# Altium project New Gyro 4.0.PrjPcb
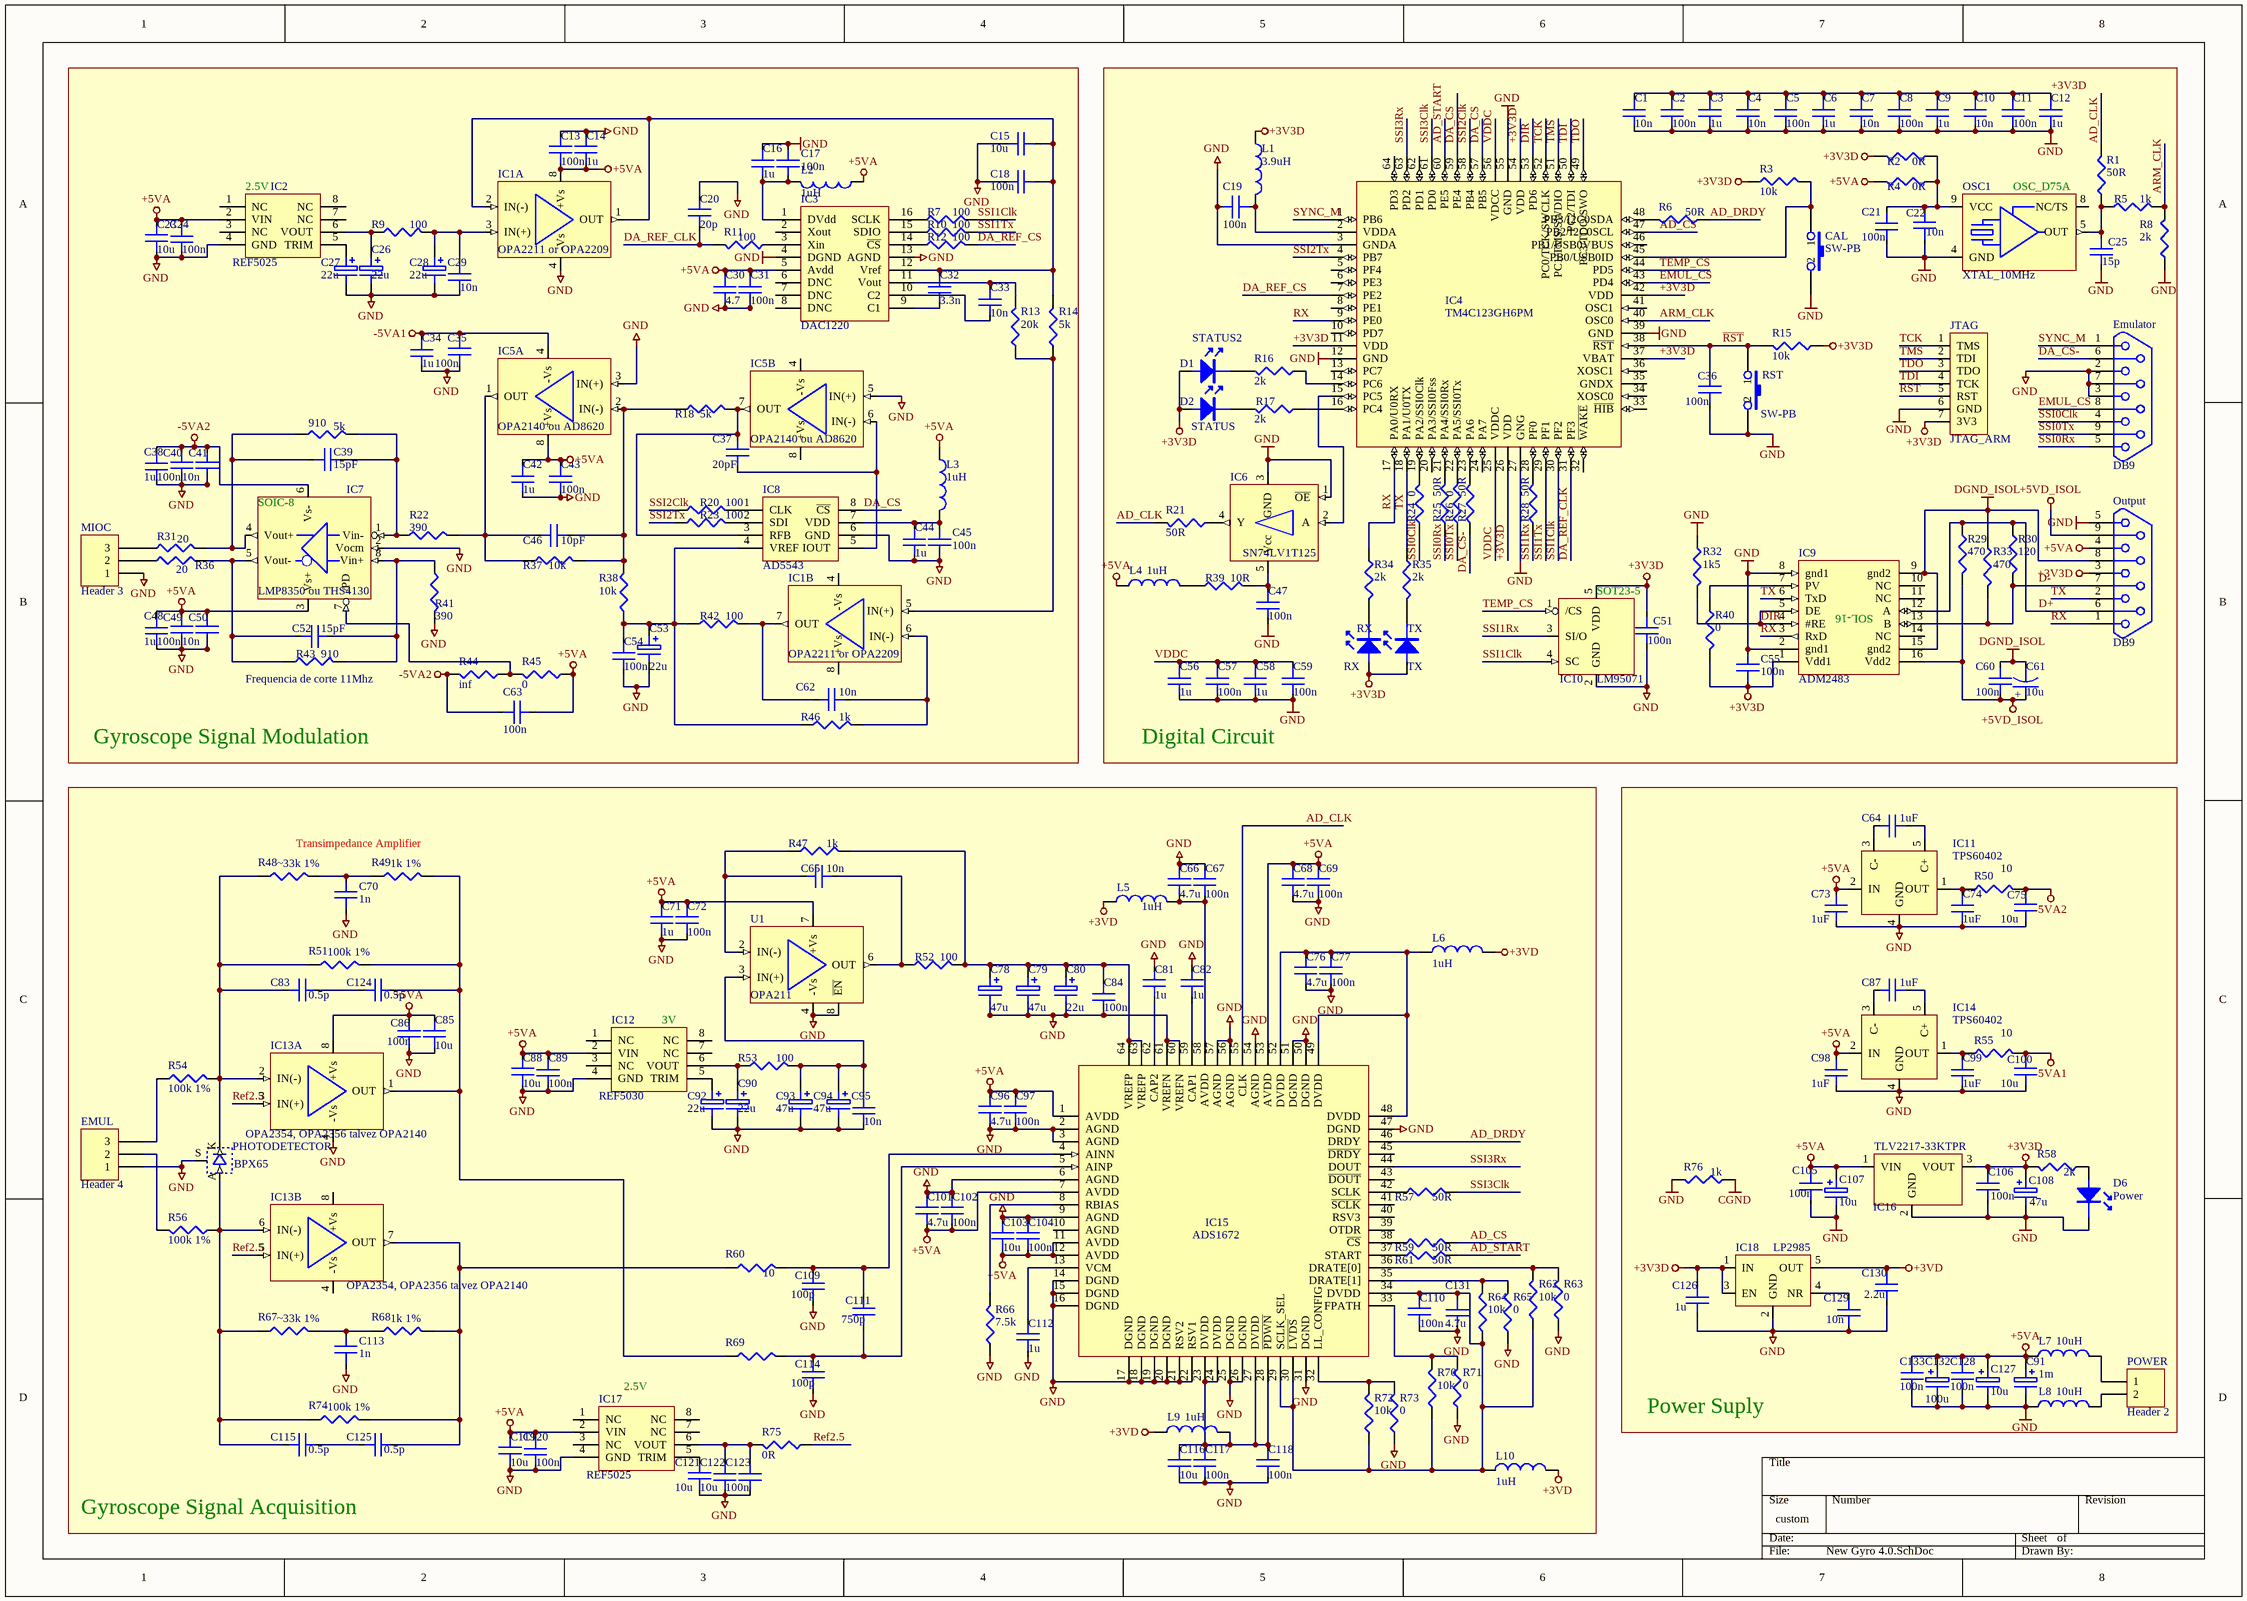
[diagram p0: New Gyro 4.0.SchDoc]
1 sheet, 253 parts. Net scope: global (net labels, ports and power ports of the same name join across sheets).
Board file: New Gyro 4.0.PcbDoc

## Sheet New Gyro 4.0.SchDoc
size 449 x 320 mm

### Parts
910  5k  [0805]
C1  10n  [0805-cap]
C2  100n  [0805-cap]
C3  1u  [0805-cap]
C4  10n  [0805-cap]
C5  100n  [0805-cap]
C6  1u  [0805-cap]
C7  10n  [0805-cap]
C8  100n  [0805-cap]
C9  1u  [0805-cap]
C10  10n  [0805-cap]
C11  100n  [0805-cap]
C12  1u  [0805-cap]
C13  100n  [0805-cap]
C14  1u  [0805-cap]
C15  10u  [0805-cap]
C16  1u  [0805-cap]
C17  100n  [0805-cap]
C18  100n  [0805-cap]
C19  100n  [0805-cap]
C20  20p  [0805-cap]
C21  100n  [0805-cap]
C22  10n  [0805-cap]
C23  10u  [0805-cap]
C24  100n  [0805-cap]
C25  15p  [0805-cap]
C26  22u  [0805-cap]
C27  22u  [0805-cap]
C28  22u  [0805-cap]
C29  10n  [0805-cap]
C30  4.7  [0805-cap]
C31  100n  [0805-cap]
C32  3.3n  [0805-cap]
C33  10n  [0805-cap]
C34  1u  [0805-cap]
C35  100n  [0805-cap]
C36  100n  [0805-cap]
C37  20pF  [0805-cap]
C38  1u  [0805-cap]
C39  15pF  [0805-cap]
C40  100n  [0805-cap]
C41  10n  [0805-cap]
C42  1u  [0805-cap]
C43  100n  [0805-cap]
C44  1u  [0805-cap]
C45  100n  [0805-cap]
C46  10pF  [0805-cap]
C47  100n  [0805-cap]
C48  1u  [0805-cap]
C49  100n  [0805-cap]
C50  10n  [0805-cap]
C51  100n  [0805-cap]
C52  15pF  [0805-cap]
C53  22u  [0805-cap]
C54  100n  [0805-cap]
C55  100n  [0805-cap]
C56  1u  [0805-cap]
C57  100n  [0805-cap]
C58  1u  [0805-cap]
C59  100n  [0805-cap]
C60  100n  [0805-cap]
C61  10u  [0805-cap]
C62  10n  [0805-cap]
C63  100n  [0805-cap]
C64  1uF  [0805-cap]
C65  10n  [0805-cap]
C66  4.7u  [0805-cap]
C67  100n  [0805-cap]
C68  4.7u  [0805-cap]
C69  100n  [0805-cap]
C70  1n  [0805-cap]
C71  1u  [0805-cap]
C72  100n  [0805-cap]
C73  1uF  [0805-cap]
C74  1uF  [0805-cap]
C75  10u  [0805-cap]
C76  4.7u  [0805-cap]
C77  100n  [0805-cap]
C78  47u  [0805-cap]
C79  47u  [0805-cap]
C80  22u  [0805-cap]
C81  1u  [0805-cap]
C82  1u  [0805-cap]
C83  0.5p  [0805-cap]
C84  100n  [0805-cap]
C85  10u  [0805-cap]
C86  100n  [0805-cap]
C87  1uF  [0805-cap]
C88  10u  [0805-cap]
C89  100n  [0805-cap]
C90  22u  [0805-cap]
C91  1m  [CAP 1000u - duplicate]
C92  22u  [0805-cap]
C93  47u  [0805-cap]
C94  47u  [0805-cap]
C95  10n  [0805-cap]
C96  4.7u  [0805-cap]
C97  100n  [0805-cap]
C98  1uF  [0805-cap]
C99  1uF  [0805-cap]
C100  10u  [0805-cap]
C101  4.7u  [0805-cap]
C102  100n  [0805-cap]
C103  10u  [0805-cap]
C104  100n  [0805-cap]
C105  100n  [0805-cap]
C106  100n  [0805-cap]
C107  10u  [0805-cap]
C108  47u  [0805-cap]
C109  100p  [0805-cap]
C110  100n  [0805-cap]
C111  750p  [0805-cap]
C112  1u  [0805-cap]
C113  1n  [0805-cap]
C114  100p  [0805-cap]
C115  0.5p  [0805-cap]
C116  10u  [0805-cap]
C117  100n  [0805-cap]
C118  100n  [0805-cap]
C119  10u  [0805-cap]
C120  100n  [0805-cap]
C121  10u  [0805-cap]
C122  10u  [0805-cap]
C123  100n  [0805-cap]
C124  0.5p  [0805-cap]
C125  0.5p  [0805-cap]
C126  1u  [0805-cap]
C127  10u  [0805-cap]
C128  100n  [0805-cap]
C129  10n  [0805-cap]
C130  2.2u  [0805-cap]
C131  4.7u  [0805-cap]
C132  100u  [1206_Capacitor]
C133  100n  [0805-cap]
CAL  SW-PB  [SW SMD]
D1  STATUS2  [LED]
D2  STATUS  [LED]
D6  Power  [LED]
EMUL  Header 4  [HDR1X3]
Emulator  DB9  [DB9FLW]
IC1  OPA2211 or OPA2209  [SO-8]  (parts A,B of 2)
IC2  REF5025  [MSOP8]
IC3  DAC1220  [DBQ 16 TI]
IC4  TM4C123GH6PM  [PQFP64]
IC5  OPA2140 ou AD8620  [MSOP8]  (parts A,B of 2)
IC6  SN74LV1T125  [SOT-23-5]
IC7  LMP8350 ou THS4130  [SO-8]
IC8  AD5543  [MSOP8]
IC9  ADM2483  [SOL-16]
IC10  LM95071  [SOT-23]
IC11  TPS60402  [SOT-23-5]
IC12  REF5030  [MSOP8]
IC13  OPA2354, OPA2356 talvez OPA2140  [MSOP8]  (parts A,B of 2)
IC14  TPS60402  [SOT-23-5]
IC15  ADS1672  [TM4C123GH6PM_PQFP64]
IC16  TLV2217-33KTPR  [KTP]
IC17  REF5025  [MSOP8]
IC18  LP2985  [SOT-23-5]
JTAG  JTAG_ARM  [HDR1X7]
L1  3.9uH  [0805]
L2  1uH  [0805]
L3  1uH  [0805]
L4  1uH  [0805]
L5  1uH  [0805]
L6  1uH  [0805]
L7  10uH  [SPD62]
L8  10uH  [SPD62]
L9  1uH  [0805]
L10  1uH  [0805]
MIOC  Header 3  [HDR1X3]
OSC1  XTAL_10MHz  [OSC_D75A_]
Output  DB9  [DB9FLW]
PHOTODETECTOR  BPX65  [otico]
POWER  Header 2  [HDR1X2]
R1  50R  [0805]
R2  0R  [0805]
R3  10k  [0805]
R4  0R  [0805]
R5  1k  [0805]
R6  50R  [0805]
R7  100  [0805]
R8  2k  [0805]
R9  100  [0805]
R10  100  [0805]
R11  100  [0805]
R12  100  [0805]
R13  20k  [0805]
R14  5k  [0805]
R15  10k  [0805]
R16  2k  [0805]
R17  2k  [0805]
R18  5k  [0805]
R20  100  [0805]
R21  50R  [0805]
R22  390  [0805]
R23  100  [0805]
R24  0  [0805]
R25  50R  [0805]
R26  0  [0805]
R27  50R  [0805]
R28  50R  [0805]
R29  470  [0805]
R30  120  [0805]
R31  20  [0805]
R32  1k5  [0805]
R33  470  [0805]
R34  2k  [0805]
R35  2k  [0805]
R36  20  [0805]
R37  10k  [0805]
R38  10k  [0805]
R39  10R  [0805]
R40  0  [0805]
R41  390  [0805]
R42  100  [0805]
R43  910  [0805]
R44  inf  [0805]
R45  0  [0805]
R46  1k  [0805]
R47  1k  [0805]
R48  ~33k 1%  [0805]
R49  1k 1%  [0805]
R50  10  [0805]
R51  100k 1%  [0805]
R52  100  [0805]
R53  100  [0805]
R54  100k 1%  [0805]
R55  10  [0805]
R56  100k 1%  [0805]
R57  50R  [0805]
R58  2k  [0805]
R59  50R  [0805]
R60  10  [0805]
R61  50R  [0805]
R62  10k  [0805]
R63  0  [0805]
R64  10k  [0805]
R65  0  [0805]
R66  7.5k  [0805]
R67  ~33k 1%  [0805]
R68  1k 1%  [0805]
R69  (no value)  [0805]
R70  10k  [0805]
R71  0  [0805]
R72  10k  [0805]
R73  0  [0805]
R74  100k 1%  [0805]
R75  0R  [0805]
R76  1k  [0805]
RST  SW-PB  [SW SMD]
RX  RX  [LED]
TX  TX  [LED]
U1  OPA211  [MSOP8]

### Blocks framed on the sheet
Gyroscope Signal Modulation: 910 C13-C18 C20 C23 C24 C26-C35 C37-C46 C48-C50 C52-C54 C62 C63 IC1-IC3 IC5 IC7 IC8 L2 L3 MIOC R7 R9-R14 R18 R20 R22 R23 R31 R36-R38 R41-R46
Digital Circuit: C1-C12 C19 C21 C22 C25 C36 C47 C51 C55-C61 CAL D1 D2 Emulator IC4 IC6 IC9 IC10 JTAG L1 L4 OSC1 Output R1-R6 R8 R15-R17 R21 R24-R30 R32-R35 R39 R40 RST RX TX
Gyroscope Signal Acquisition: C65-C72 C76-C86 C88-C90 C92-C97 C101-C104 C109-C125 C131 EMUL IC12 IC13 IC15 IC17 L5 L6 L9 L10 PHOTODETECTOR R47-R49 R51-R54 R56 R57 R59-R75 U1
Power Suply: C64 C73-C75 C87 C91 C98-C100 C105-C108 C126-C130 C132 C133 D6 IC11 IC14 IC16 IC18 L7 L8 POWER R50 R55 R58 R76

### Nets
+3V3D: C1.2 C2.2 C3.2 C4.2 C5.2 C6.2 C7.2 C8.2 C9.2 C10.2 C11.2 C12.2 C51.2 C55.2 C106.2 C108.1(+) C126.2 D1.A(a) D2.A(a) IC4.11(VDD) IC4.26(VDD) IC4.37(VBAT) IC4.42(VDD) IC4.54(VDD) IC9.1(Vdd1) IC10.5(VDD) IC16.3(VOUT) IC18.1(IN) IC18.3(EN) JTAG.7(3V3) L1.1 Output.3 R2.2 R3.1 R15.1 R40.2 R58.2 RX.A(a) TX.A(a)
+3VD: C130.2 IC18.5(OUT) L5.1 L6.2 L9.1 L10.2
+5VA: C13.2 C14.2 C23.1 C24.2 C30.2 C31.2 C42.2 C43.2 C48.2 C49.1 C50.1 C63.1 C68.1 C69.1 C71.1 C72.1 C73.2 C85.1 C86.1 C88.1 C89.2 C91.1(+) C96.1 C97.1 C98.2 C101.2 C102.2 C103.2 C104.2 C105.2 C107.1(+) C119.1 C120.2 C127.1(+) C128.2 C132.1(+) C133.2 IC1.8(+Vs) IC2.2(VIN) IC3.5(Avdd) IC5.8(+Vs) IC7.3(Vs+) IC11.2(IN) IC12.2(VIN) IC13.8(+Vs) IC14.2(IN) IC15.1(AVDD) IC15.7(AVDD) IC15.11(AVDD) IC15.12(AVDD) IC15.53(AVDD) IC16.1(VIN) IC17.2(VIN) L2.1 L3.1 L4.1 L7.1 Output.4 R4.2 R45.1 U1.7(+Vs)
+5VD_ISOL: C60.1 C61.1 IC9.16(Vdd2) Output.9 R29.2
-5VA1: C34.2 C35.1 C100.1 IC5.4(-Vs) R55.2
-5VA2: C38.2 C40.1 C41.1 C63.2 C75.1 IC7.6(Vs-) R44.2 R50.2
CGND: R76.1
DGND_ISOL: C60.2 C61.2 IC9.9(gnd2) IC9.15(gnd2) Output.8 R33.1
GND: C1.1 C2.1 C3.1 C4.1 C5.1 C6.1 C7.1 C8.1 C9.1 C10.1 C11.1 C12.1 C13.1 C14.1 C15.1 C16.2 C17.2 C18.1 C19.1 C20.1 C21.1 C22.2 C23.2 C24.1 C25.1 C26.2(-) C27.2(-) C28.2(-) C29.1 C30.1 C31.1 C34.1 C35.2 C36.2 C38.1 C40.2 C41.2 C42.1 C43.1 C44.1 C45.1 C47.1 C48.1 C49.2 C50.2 C51.1 C53.2(-) C54.1 C55.1 C56.1 C57.1 C58.1 C59.1 C66.1 C67.1 C68.2 C69.2 C70.2 C71.2 C72.2 C73.1 C74.1 C75.2 C76.2 C77.2 C78.2(-) C79.2(-) C80.2(-) C81.1 C82.1 C84.1 C85.2 C86.2 C88.2 C89.1 C90.2(-) C91.2(-) C92.2(-) C93.2(-) C94.2(-) C95.1 C96.2 C97.2 C98.1 C99.1 C100.2 C101.1 C102.1 C103.1 C104.1 C105.1 C106.1 C107.2(-) C108.2(-) C109.2 C110.2 C112.2 C113.2 C114.2 C116.2 C117.2 C118.2 C119.2 C120.1 C121.2 C122.1 C123.1 C126.1 C127.2(-) C128.1 C129.1 C130.1 C131.1 C132.2(-) C133.1 CAL.2 D6.K EMUL.1 Emulator.2 Emulator.3 Emulator.7 IC1.4(-Vs) IC2.4(GND) IC3.4(DGND) IC3.13(AGND) IC4.3(GNDA) IC4.12(GND) IC4.27(GNG) IC4.39(GND) IC4.55(GND) IC5.3(IN(+)) IC5.5(IN(+)) IC6.1(~{OE}) IC6.3(GND) IC7.2(Vocm) IC8.6(GND) IC9.2(gnd1) IC9.8(gnd1) IC10.2(GND) IC11.4(GND) IC12.4(GND) IC13.4(-Vs) IC14.4(GND) IC15.2(AGND) IC15.3(AGND) IC15.6(AGND) IC15.9(AGND) IC15.14(DGND) IC15.15(DGND) IC15.16(DGND) IC15.17(DGND) IC15.18(DGND) IC15.19(DGND) IC15.20(DGND) IC15.21(RSV2) IC15.22(RSV1) IC15.25(DGND) IC15.26(DGND) IC15.31(DGND) IC15.47(DGND) IC15.50(DGND) IC15.51(DGND) IC15.54(AGND) IC15.56(AGND) IC15.57(AGND) IC15.60(VREFN) IC15.61(VREFN) IC16.2(GND) IC17.4(GND) IC18.2(GND) JTAG.6(GND) L8.1 MIOC.1 OSC1.4(GND) Output.5 PHOTODETECTOR.S R8.1 R32.1 R41.2 R63.1 R65.1 R66.1 R71.1 R73.1 R76.2 RST.2 U1.4(-Vs) U1.8(~{EN})
~{RST}: C36.1 IC4.38(~{RST}) JTAG.5(RST) R15.2 RST.1
AD_CLK: IC15.55(CLK) R1.2 R21.2
AD_CS: IC4.47(PB2/I2C0SCL) R59.2
AD_DRDY: IC15.46(DRDY) R6.1
AD_START: IC4.60(PE5) R61.2
ARM_CLK: IC4.40(OSC0) R5.2 R8.2
D+: IC9.12(A) Output.6 R29.1 R30.1
D-: IC9.13(B) Output.7 R30.2 R33.2
DA_CS: IC4.57(PB5) IC4.59(PE4) IC8.8(~{CS})
DA_CS-: Emulator.6 R27.1
DA_REF_CLK: C20.2 IC4.31(PF3) R11.2
DA_REF_CS: IC4.7(PE2) R12.2
DIR: IC4.53(PD6) IC9.4(#RE) IC9.5(DE) R32.2
EMUL_CS: Emulator.8 IC4.43(PD4)
Ref2.5: IC13.3(IN(+)) IC13.5(IN(+)) R75.1
RX: IC4.9(PE0) IC4.17(PA0/U0RX) IC9.3(RxD) Output.1 R34.1
SSI0Clk: Emulator.4 R24.1
SSI0Rx: Emulator.5 R25.1
SSI0Tx: Emulator.9 R26.1
SSI1Clk: IC4.30(PF2) IC10.4(SC) R7.2
SSI1Rx: IC10.3(SI/O) R28.1
SSI1Tx: IC4.29(PF1) R10.2
SSI2Clk: IC4.58(PB4) R20.1
SSI2Tx: IC4.4(PB7) R23.1
SSI3Clk: IC4.61(PD0) R57.2
SSI3Rx: IC4.63(PD2) IC15.44(DOUT)
SYNC_M: Emulator.1 IC4.1(PB6)
TCK: IC4.52(PC0/TCK/SWCLK) JTAG.1(TMS)
TDI: IC4.50(PC2/TDI) JTAG.4(TCK)
TDO: IC4.49(PC3/TDO/SWO) JTAG.3(TDO)
TEMP_CS: IC4.44(PD5) IC10.1(/CS)
TMS: IC4.51(PC1/TMS/SWDIO) JTAG.2(TDI)
TX: IC4.18(PA1/U0TX) IC9.6(TxD) Output.2 R35.1
VDDC: C56.2 C57.2 C58.2 C59.2 IC4.25(VDDC) IC4.56(VDCC)
Net910_1: 910.1 C39.2 IC7.4(Vout+) R31.2
Net910_2: 910.2 C39.1 IC7.1(Vin-) R22.1
NetC15_2: C15.2 C18.2 C32.2 IC1.1(OUT) IC1.2(IN(-)) IC3.12(Vref) R14.2
NetC16_1: C16.1 C17.1 IC3.1(DVdd) L2.2
NetC19_2: C19.2 IC4.2(VDDA) L1.2
NetC21_2: C21.2 C22.1 OSC1.9(VCC) R2.1 R4.1
NetC25_2: C25.2 OSC1.5(OUT) R1.1 R5.1
NetC26_1: C26.1(+) IC2.6(VOUT) R9.1
NetC27_1: C27.1(+) IC2.5(TRIM)
NetC28_1: C28.1(+) C29.2 IC1.3(IN(+)) R9.2
NetC32_1: C32.1 IC3.9(C1)
NetC33_1: C33.1 IC3.10(C2)
NetC33_2: C33.2 IC3.11(Vout) R13.2
NetC37_1: C37.1 IC5.7(OUT) IC8.3(RFB) R18.2
NetC37_2: C37.2 IC5.6(IN(-)) IC8.5(IOUT)
NetC44_2: C44.2 C45.2 IC8.7(VDD) L3.2
NetC46_1: C46.1 IC5.1(OUT) R22.2 R37.1
NetC46_2: C46.2 IC5.2(IN(-)) R18.1 R37.2 R38.2
NetC47_2: C47.2 IC6.5(Vcc) R39.2
NetC52_1: C52.1 IC7.8(Vin+) R41.1 R43.2
NetC52_2: C52.2 IC7.5(Vout-) R36.2 R43.1
NetC53_1: C53.1(+) C54.2 IC8.4(VREF) R38.1 R42.1 R46.1
NetC62_1: C62.1 IC1.7(OUT) R42.2
NetC62_2: C62.2 IC1.6(IN(-)) R46.2
NetC64_1: C64.1 IC11.3(C-)
NetC64_2: C64.2 IC11.5(C+)
NetC65_1: C65.1 R47.1 U1.2(IN(-))
NetC65_2: C65.2 R52.1 U1.6(OUT)
NetC66_2: C66.2 C67.2 IC15.58(AVDD) L5.2
NetC70_1: C70.1 R48.2 R49.1
NetC74_2: C74.2 IC11.1(OUT) R50.1
NetC76_1: C76.1 C77.1 IC15.48(DVDD) IC15.49(DVDD) IC15.52(DVDD) L6.1
NetC78_1: C78.1(+) C79.1(+) C80.1(+) C84.2 IC15.63(VREFP) IC15.64(VREFP) R47.2 R52.2
NetC81_2: C81.2 IC15.62(CAP2)
NetC82_2: C82.2 IC15.59(CAP1)
NetC83_1: C83.1 C124.2
NetC83_2: C83.2 IC13.2(IN(-)) PHOTODETECTOR.K R48.1 R51.1 R54.2
NetC87_1: C87.1 IC14.3(C-)
NetC87_2: C87.2 IC14.5(C+)
NetC90_1: C90.1(+) IC12.6(VOUT) R53.1
NetC92_1: C92.1(+) IC12.5(TRIM)
NetC93_1: C93.1(+) C94.1(+) C95.2 R53.2 U1.3(IN(+))
NetC99_2: C99.2 IC14.1(OUT) R55.1
NetC109_1: C109.1 C111.1 IC15.4(AINN) R60.2
NetC110_1: C110.1 C131.2 IC15.29(SCLK_SEL) IC15.30(~{LVDS}) IC15.34(DVDD) L10.1 R62.1 R64.1 R70.1 R72.1
NetC111_2: C111.2 C114.1 IC15.5(AINP) R69.2
NetC112_1: C112.1 IC15.13(VCM)
NetC113_1: C113.1 R67.2 R68.1
NetC115_1: C115.1 C125.2
NetC115_2: C115.2 IC13.6(IN(-)) PHOTODETECTOR.A R56.1 R67.1 R74.1
NetC116_1: C116.1 C117.1 C118.1 IC15.23(DVDD) IC15.24(DVDD) IC15.27(DVDD) IC15.28(~{PDWN}) L9.2
NetC121_1: C121.1 IC17.5(TRIM)
NetC122_2: C122.2 C123.2 IC17.6(VOUT) R75.2
NetC124_1: C124.1 IC13.1(OUT) R49.2 R51.2 R69.1
NetC125_1: C125.1 IC13.7(OUT) R60.1 R68.2 R74.2
NetC129_2: C129.2 IC18.4(NR)
NetCAL_1: CAL.1 IC4.45(PB0/USB0ID) R3.2
NetD1_K: D1.K R16.2
NetD2_K: D2.K R17.2
NetD6_A: D6.A(a) R58.1
NetEMUL_2: EMUL.2 R56.2
NetEMUL_3: EMUL.3 R54.1
NetIC1_5: IC1.5(IN(+)) R13.1 R14.1
NetIC3_3: IC3.3(Xin) R11.1
NetIC3_14: IC3.14(~{CS}) R12.1
NetIC3_15: IC3.15(SDIO) R10.1
NetIC3_16: IC3.16(SCLK) R7.1
NetIC4_14: IC4.14(PC6) R16.1
NetIC4_15: IC4.15(PC5) IC6.2(A)
NetIC4_16: IC4.16(PC4) R17.1
NetIC4_19: IC4.19(PA2/SSI0Clk) R24.2
NetIC4_21: IC4.21(PA4/SSI0Rx) R25.2
NetIC4_22: IC4.22(PA5/SSI0Tx) R26.2
NetIC4_23: IC4.23(PA6) R27.2
NetIC4_28: IC4.28(PF0) R28.2
NetIC4_48: IC4.48(PB3/I2C0SDA) R6.2
NetIC6_4: IC6.4(Y) R21.1
NetIC7_7: IC7.7(/PD) R44.1 R45.2
NetIC8_1: IC8.1(CLK) R20.2
NetIC8_2: IC8.2(SDI) R23.2
NetIC9_7: IC9.7(PV) R40.1
NetIC15_8: IC15.8(RBIAS) R66.2
NetIC15_32: IC15.32(LL_CONFIG) R72.2 R73.2
NetIC15_33: IC15.33(FPATH) R70.2 R71.2
NetIC15_35: IC15.35(DRATE[1]) R64.2 R65.2
NetIC15_36: IC15.36(DRATE[0]) R62.2 R63.2
NetIC15_37: IC15.37(START) R61.1
NetIC15_38: IC15.38(~{CS}) R59.1
NetIC15_42: IC15.42(SCLK) R57.1
NetL4_2: L4.2 R39.1
NetL7_2: L7.2 POWER.1
NetL8_2: L8.2 POWER.2
NetMIOC_2: MIOC.2 R36.1
NetMIOC_3: MIOC.3 R31.1
NetR34_2: R34.2 RX.K
NetR35_2: R35.2 TX.K

Not connected (* = marked no-connect by the designer): IC2 1(NC) 3(NC) 7(NC) 8(NC); IC3 2(Xout) 6(DNC) 7(DNC) 8(DNC); IC4 5(PF4) 6(PE3) 8(PE1) 10(PD7) 13(PC7) 20(PA3/SSI0Fss) 24(PA7) 32(~{WAKE}) 33(~{HIB}) 34(XOSC0) 35(GNDX) 36(XOSC1) 41(OSC1) 46(PB1/USB0VBUS) 62(PD1) 64(PD3); IC9 10(NC) 11(NC) 14(NC); IC12 1(NC) 3(NC) 7(NC) 8(NC); IC15 10(AGND) 39(OTDR) 40(RSV3) 41(~{SCLK}) 43(~{DOUT}) 45(~{DRDY}); IC17 1(NC) 3(NC) 7(NC) 8(NC); OSC1 8(NC/TS)

### Notes on the sheet
- (near IC2) 2.5V
- (near OSC1) OSC_D75A
- (near IC7) SOIC-8
- (near IC10) SOT23-5
- (near IC9) SOL-16
- (near R43) Frequencia de corte 11Mhz
- Transimpedance Amplifier
- (near IC12) 3V
- (near IC17) 2.5V
- (in symbol CAPACITOR POL) +

### Library data of the parts
910 R6 R7 R9-R14 R18 R20 R22-R28 R32 R37 R38 R40-R57 R59-R74 = R08: Resistor Thick film 1%
C1-C25 C29-C52 C54-C60 C62-C77 C81-C89 C95-C106 C109-C126 C128-C131 C133 = CAP: Capacitor Thick film
C26-C28 C53 C78-C80 C90-C94 C107 C108 C127 C132 = CAPT: Capacitor Tântalo SMD
C61 = CAPACITOR POL: Capacitor Tântalo
CAL RST = SW
D1 D2 D6 RX TX = LED_CV: SMD LED 0805 package
EMUL MIOC = Header 3: Header, 3-Pin; LatestRevisionDate: 17-Jul-2002; LatestRevisionNote: Re-released for DXP Platform.; Publisher: Altium Limited
IC1 IC5 IC13 = AMPOPDUAL
IC2 IC12 IC17 = ADR440AMZ
IC4 = TM4C123GH6PM: ARM M4F Texas
IC6 = SN74LV1T125: Single Power Supply Single Buffer Gate with 3-State Output CMOS Logic  Level Shifter
IC7 = THS4505: WIDEBAND, LOW-DISTORTION, FULLY DIFFERENTIAL AMPLIFIER
IC8 = AD5543: 16 Bit SPI DAC
IC11 IC14 = TPS60401: Charge Pump Inverter
IC15 = ADS1672: 625kSPS, 24-Bit Analog-to-Digital Converter
IC16 = LM78L05AC/TO3_0: Text Field1: 70; Text Field2: 40
L1-L10 = L: Text Field1: 40; Text Field2: 10
OSC1 = XTAL_D75A
PHOTODETECTOR = BYW29-150: Text Field1: 10; Text Field2: 20
POWER = Header 2: Header, 2-Pin; LatestRevisionDate: 17-Jul-2002; LatestRevisionNote: Re-released for DXP Platform.; Publisher: Altium Limited
R1 R5 R8 R21 R39 = RES: Resistor; TC: *
R2-R4 R15-R17 R29-R31 R33-R36 R58 R75 R76 = R06: Resistor Thick film 5%